# Altium project bldcDriver.PrjPcb
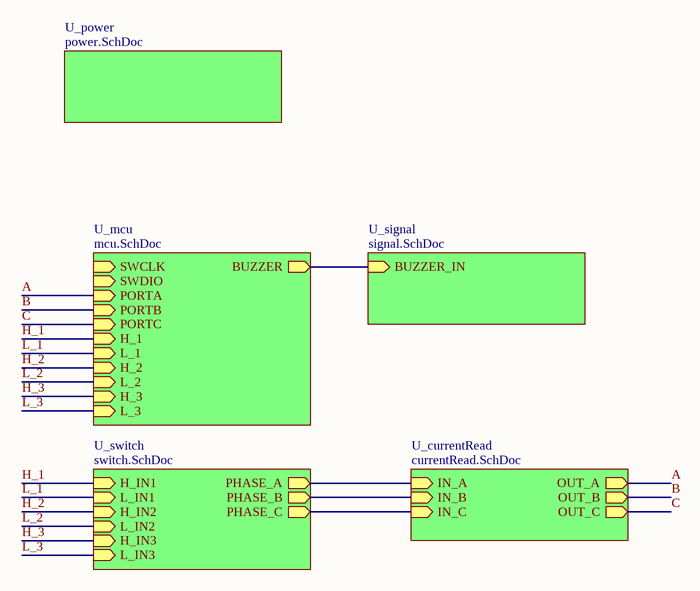
[diagram p0: main.SchDoc]
8 sheets, 67 parts. Net scope: hierarchical (ports join the sheet entries above them; power ports are global).
Board file: bldcPCB.PcbDoc
Sheets:
  main.SchDoc
    U_currentRead = currentRead.SchDoc
    U_power = power.SchDoc
    U_signal = signal.SchDoc
    U_switch = switch.SchDoc
    U_mcu = mcu.SchDoc
  requirements.SchDoc
  calculations.SchDoc

## Sheet main.SchDoc
size A4

### Sub-sheets
U_currentRead = currentRead.SchDoc: OUT_A (out), IN_A (in), OUT_B (out), IN_B (in), OUT_C (out), IN_C (in)
U_mcu = mcu.SchDoc: SWCLK (in), SWDIO (in), PORTA (in), PORTB (in), PORTC (in), BUZZER (out), H_1 (in), L_1 (in), H_2 (in), L_2 (in), H_3 (in), L_3 (in)
U_power = power.SchDoc: no entries
U_signal = signal.SchDoc: BUZZER_IN (in)
U_switch = switch.SchDoc: H_IN1 (in), L_IN1 (in), PHASE_A (out), H_IN2 (in), L_IN2 (in), PHASE_B (out), H_IN3 (in), L_IN3 (in), PHASE_C (out)

### Nets
A: sheet U_currentRead/OUT_A, sheet U_mcu/PORTA
B: sheet U_currentRead/OUT_B, sheet U_mcu/PORTB
C: sheet U_currentRead/OUT_C, sheet U_mcu/PORTC
H_1: sheet U_switch/H_IN1, sheet U_mcu/H_1
H_2: sheet U_switch/H_IN2, sheet U_mcu/H_2
H_3: sheet U_switch/H_IN3, sheet U_mcu/H_3
L_1: sheet U_switch/L_IN1, sheet U_mcu/L_1
L_2: sheet U_switch/L_IN2, sheet U_mcu/L_2
L_3: sheet U_switch/L_IN3, sheet U_mcu/L_3
NetC3_2: sheet U_currentRead/IN_A, sheet U_switch/PHASE_A
NetC4_2: sheet U_currentRead/IN_C, sheet U_switch/PHASE_C
NetC8_2: sheet U_currentRead/IN_B, sheet U_switch/PHASE_B
NetR23_2: sheet U_signal/BUZZER_IN, sheet U_mcu/BUZZER

## Sheet currentRead.SchDoc
size A4
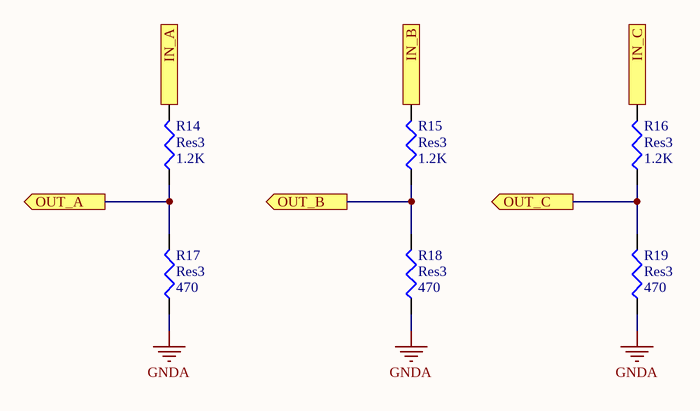
[diagram p1: currentRead.SchDoc]

### Parts
R14  Res3  value 1.2K  [12Z-2010]
R15  Res3  value 1.2K  [12Z-2010]
R16  Res3  value 1.2K  [12Z-2010]
R17  Res3  value 470  [12Z-2010]
R18  Res3  value 470  [12Z-2010]
R19  Res3  value 470  [12Z-2010]

### Ports
IN_A (in), IN_B (in), IN_C (in), OUT_A (out), OUT_B (out), OUT_C (out)

### Nets
GNDA: R17.1 R18.1 R19.1  [project net COMM]
A: R14.1 R17.2 ; port OUT_A
B: R15.1 R18.2 ; port OUT_B
C: R16.1 R19.2 ; port OUT_C
NetC3_2: R14.2 ; port IN_A
NetC4_2: R16.2 ; port IN_C
NetC8_2: R15.2 ; port IN_B

### Library data of the parts
R14-R19 = Res3: Resistor; Published: 8-Jun-2000; LatestRevisionDate: 29-May-2009; LatestRevisionNote: IPC-7351 Footprint Added.; PackageReference: J1-0603; Publisher: Altium Limited; PackageDescription: Chip Resistor

## Sheet power.SchDoc
size A4
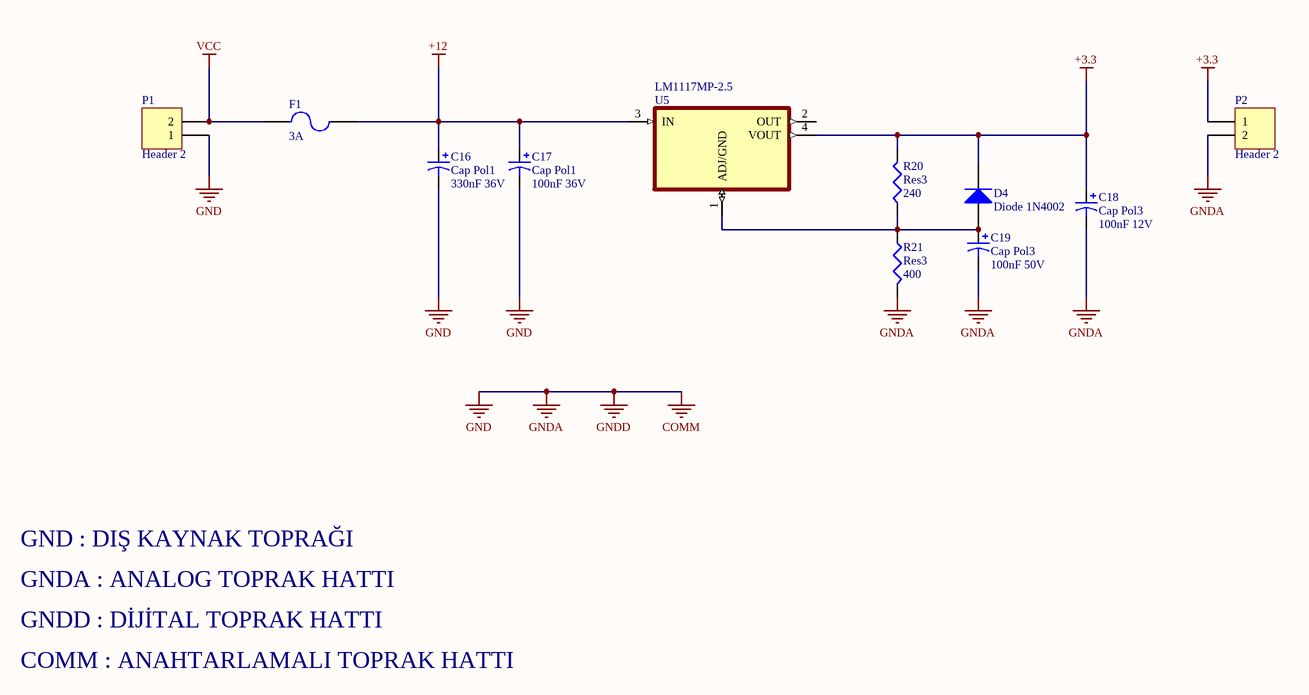
[diagram p2: power.SchDoc]

### Parts
C16  Cap Pol1  value 330nF 36V  [RB7.6-15]
C17  Cap Pol1  value 100nF 36V  [RB7.6-15]
C18  Cap Pol3  value 100nF 12V  [C0805]
C19  Cap Pol3  value 100nF 50V  [C0805]
D4  Diode 1N4002  [DO-41]
F1  3A  [PIN-W2/E2.8]
P1  Header 2  [HDR1X2]
P2  Header 2  [HDR1X2]
R20  Res3  value 240  [J1-0603]
R21  Res3  value 400  [J1-0603]
U5  LM1117MP-2.5  [LM1117 SMD]

### Nets
+3.3: C18.1 D4.2(K) P2.1 R20.2 U5.4(VOUT)
+12: C16.1 C17.1 F1.2 U5.3(IN)
COMM: C16.2 C17.2 C18.2 C19.2 P1.1 P2.2 R21.2  [also labelled GND, GNDA, GNDD]
VCC: F1.1 P1.2
NetC19_1: C19.1 D4.1(A) R20.1 R21.1 U5.1(ADJ/GND)

Not connected (* = marked no-connect by the designer): U5 2(OUT)

### Notes on the sheet
- GND : DIŞ KAYNAK TOPRAĞI
- GNDA : ANALOG TOPRAK HATTI
- GNDD : DİJİTAL TOPRAK HATTI
- COMM : ANAHTARLAMALI TOPRAK HATTI

### Library data of the parts
C16 C17 = Cap Pol1: Polarized Capacitor (Radial); Published: 8-Jun-2000; LatestRevisionDate: 17-Jul-2002; LatestRevisionNote: Re-released for DXP Platform.; PackageReference: RB7.6-15; Publisher: Altium Limited; PackageDescription: Polarized Capacitor (Radial); 2 Leads
C18 C19 = Cap Pol3: Polarized Capacitor (Surface Mount); Published: 8-Jun-2000; LatestRevisionDate: 29-May-2009; LatestRevisionNote: IPC-7351 Footprint Added.; PackageReference: C0805; Publisher: Altium Limited; PackageDescription: Chip Capacitor
D4 = Diode 1N4007: 1 Amp General Purpose Rectifier; Published: 8-Jun-2000; LatestRevisionDate: 17-Jul-2002; LatestRevisionNote: Re-released for DXP Platform.; DatasheetVersion: 1998; PackageVersion: Aug-1999; PackageReference: DO-41; Publisher: Altium Limited; PackageDescription: Diode, Axial; Body 5.2 x 2.7 mm (LxDia. max), Lead Dia. 0.86 mm (max); Code_JEDEC: DO-204-AL; ComponentLink1Description: Manufacturer Link; ComponentLink1URL: http://www.fairchildsemi.com/; ComponentLink2Description: Datasheet; ComponentLink2URL: http://www.fairchildsemi.com/ds/1N%2F1N4001.pdf
F1 = Fuse 2: Fuse; Published: 8-Jun-2000; LatestRevisionDate: 17-Jul-2002; LatestRevisionNote: Re-released for DXP Platform.; PackageReference: PIN-W2/E2.8; Publisher: Altium Limited; PackageDescription: Thru-Hole; 2 Leads
P1 P2 = Header 2: Header, 2-Pin; LatestRevisionDate: 17-Jul-2002; LatestRevisionNote: Re-released for DXP Platform.; Publisher: Altium Limited
R20 R21 = Res3: Resistor; Published: 8-Jun-2000; LatestRevisionDate: 29-May-2009; LatestRevisionNote: IPC-7351 Footprint Added.; PackageReference: J1-0603; Publisher: Altium Limited; PackageDescription: Chip Resistor
U5 = LM1117MP-2.5: 800-mA 15-V linear voltage regulator 4-SOT-223 0 to 125; MP: LM1117MP-2.5/NOPB; MF: Texas Instruments; Purchase-URL: https://pricing.snapeda.com/search/part/LM1117MP-2.5/NOPB/?ref=eda; SnapEDA_Link: https://www.snapeda.com/parts/LM1117MP-2.5/NOPB/Texas%20Instruments/view-part/108187/?ref=snap; Availability: Warning; Package: SOT-223-4 Texas Instruments; Value: *; Price: None; Check_prices: https://www.snapeda.com/parts/LM1117MP-2.5/NOPB/Texas%20Instruments/view-part/108187/?ref=eda

## Sheet signal.SchDoc
size A4
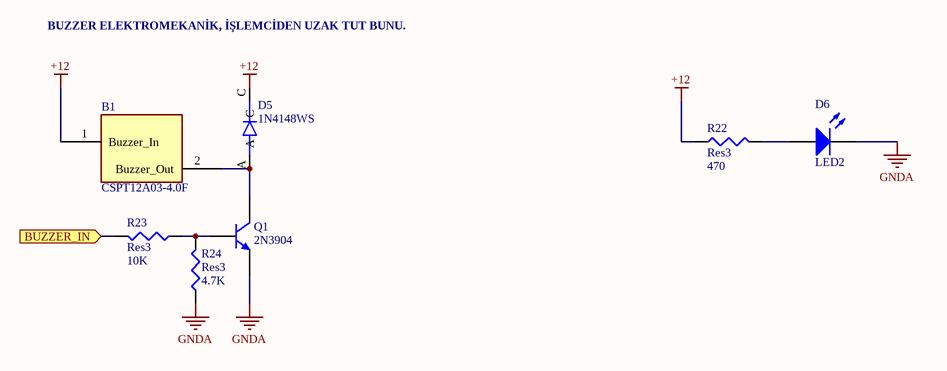
[diagram p3: signal.SchDoc]

### Parts
B1  CSPT12A03-4.0F  [Buzzer SMD]
D5  1N4148WS  [1N4148WS]
D6  LED2  [3.2X1.6X1.1]
Q1  2N3904  [TO-92A]
R22  Res3  value 470  [12Z-2010]
R23  Res3  value 10K  [J1-0603]
R24  Res3  value 4.7K  [J1-0603]

### Ports
BUZZER_IN (in)

### Nets
+12: B1.1(Buzzer_In) D5.C R22.1
GNDA: D6.2(K) Q1.1(E) R24.1  [project net COMM]
NetB1_2: B1.2(Buzzer_Out) D5.A Q1.3(C)
NetD6_1: D6.1(A) R22.2
NetQ1_2: Q1.2(B) R23.1 R24.2
NetR23_2: R23.2 ; port BUZZER_IN

### Notes on the sheet
- BUZZER ELEKTROMEKANİK, İŞLEMCİDEN UZAK TUT BUNU.

### Library data of the parts
B1 = Buzzer SMD 5MM: 12V 1mA 5MM 85dB 7.5X7.5X2 SMD Buzzer without circuit
D5 = 1N4148WS: Diode Standard 75V 150mA Surface Mount SOD-323F; MF: ON Semiconductor; Price: None; SnapEDA_Link: https://www.snapeda.com/parts/1N4148WS/ON%20Semiconductor/view-part/2747266/?ref=snap; Check_prices: https://www.snapeda.com/parts/1N4148WS/ON%20Semiconductor/view-part/2747266/?ref=eda; MP: 1N4148WS; Availability: Good; Value: *; Purchase-URL: https://pricing.snapeda.com/search/part/1N4148WS/?ref=eda; Package: SOD-323FL-2 ON Semiconductor
D6 = LED2: Typical RED, GREEN, YELLOW, AMBER GaAs LED; Published: 8-Jun-2000; LatestRevisionDate: 17-Jul-2002; LatestRevisionNote: Re-released for DXP Platform.; PackageVersion: Feb-2002; PackageReference: 3.2X1.6X1.1; Publisher: Altium Limited; PackageDescription: SM LED; 2 Flat Leads
Q1 = 2N3904: NPN General Purpose Amplifier; Published: 8-Jun-2000; LatestRevisionDate: 15-Jan-2003; LatestRevisionNote: PCB Footprint 'BCY-W3/D4.7' replaced; DatasheetVersion: 1997; PackageVersion: Sep-1998; PackageReference: TO-92A; Publisher: Altium Limited; PackageDescription: TO, Flat Index; 3 In-Line, Axial Leads; Body Dia. 4.5mm; Leads 0.51 x 0.48 mm (max); ComponentLink1Description: Manufacturer Link; ComponentLink1URL: http://www.fairchildsemi.com/; ComponentLink2Description: Datasheet; ComponentLink2URL: http://www.fairchildsemi.com/ds/2N%2F2N3904.pdf
R22-R24 = Res3: Resistor; Published: 8-Jun-2000; LatestRevisionDate: 29-May-2009; LatestRevisionNote: IPC-7351 Footprint Added.; PackageReference: J1-0603; Publisher: Altium Limited; PackageDescription: Chip Resistor

## Sheet switch.SchDoc
size A4
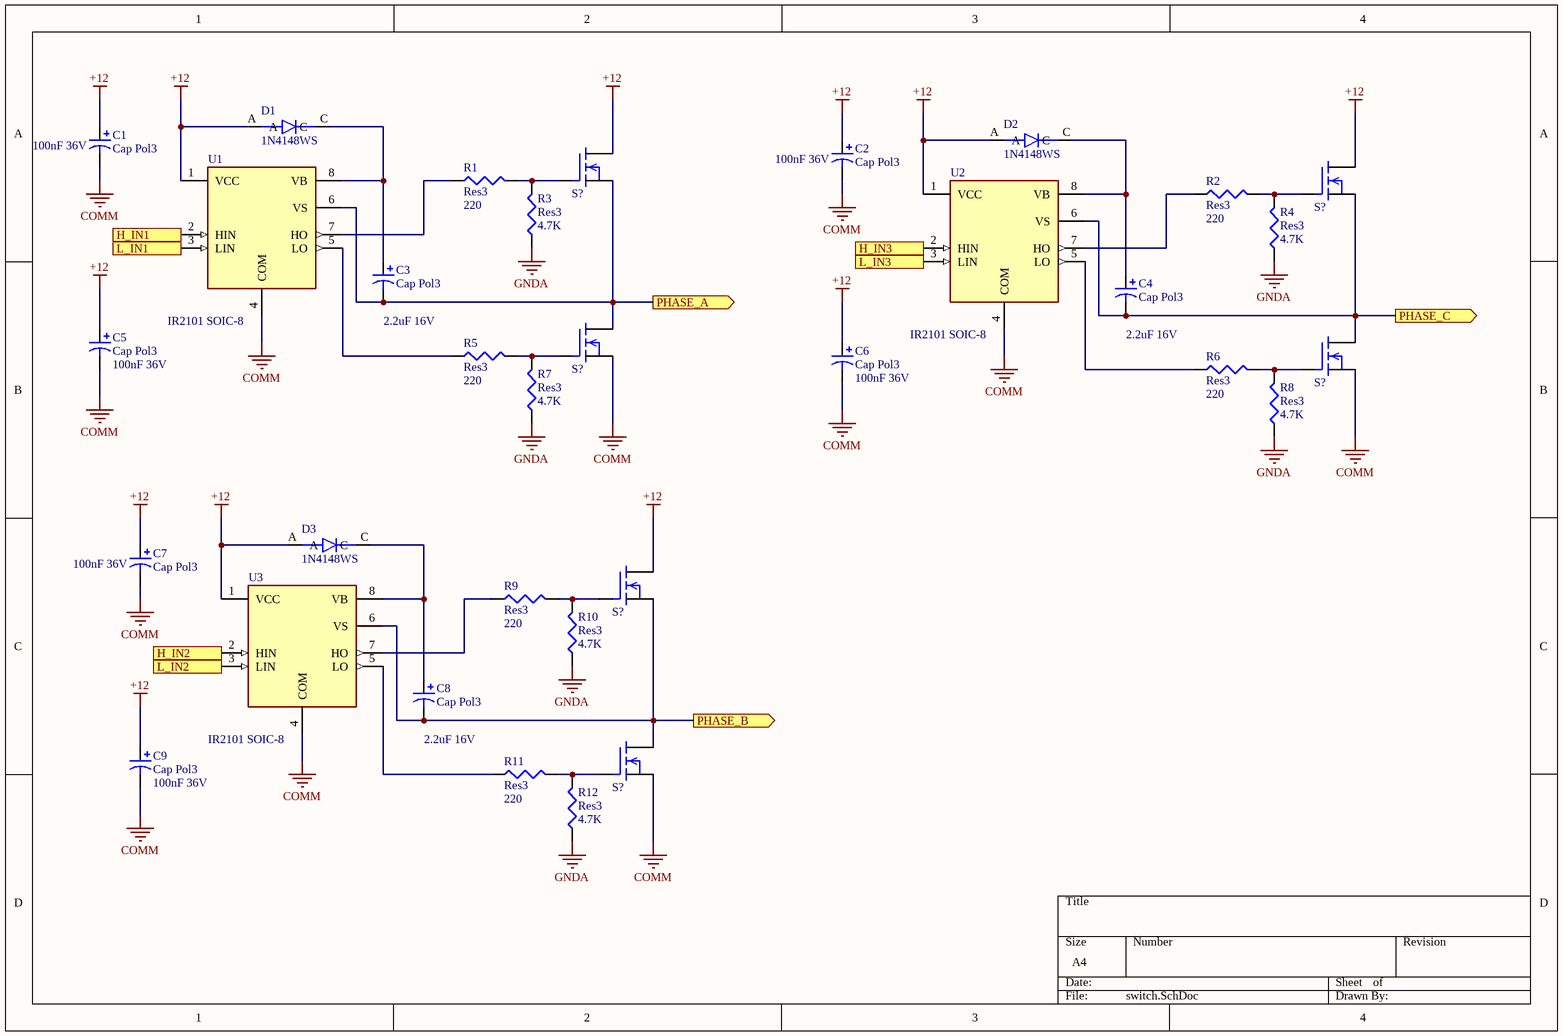
[diagram p4: switch.SchDoc]

### Parts
C1  Cap Pol3  value 100nF 36V  [C0805]
C2  Cap Pol3  value 100nF 36V  [C0805]
C3  Cap Pol3  value 2.2uF 16V  [C0805]
C4  Cap Pol3  value 2.2uF 16V  [C0805]
C5  Cap Pol3  value 100nF 36V  [C0805]
C6  Cap Pol3  value 100nF 36V  [C0805]
C7  Cap Pol3  value 100nF 36V  [C0805]
C8  Cap Pol3  value 2.2uF 16V  [C0805]
C9  Cap Pol3  value 100nF 36V  [C0805]
D1  1N4148WS  [1N4148WS]
D2  1N4148WS  [1N4148WS]
D3  1N4148WS  [1N4148WS]
NPN_1  S?  [UTM2054G - duplicate]
NPN_2  S?  [UTM2054G - duplicate]
NPN_3  S?  [UTM2054G - duplicate]
NPN_4  S?  [UTM2054G - duplicate]
NPN_5  S?  [UTM2054G - duplicate]
NPN_6  S?  [UTM2054G - duplicate]
R1  Res3  value 220  [J1-0603]
R2  Res3  value 220  [J1-0603]
R3  Res3  value 4.7K  [J1-0603]
R4  Res3  value 4.7K  [J1-0603]
R5  Res3  value 220  [J1-0603]
R6  Res3  value 220  [J1-0603]
R7  Res3  value 4.7K  [J1-0603]
R8  Res3  value 4.7K  [J1-0603]
R9  Res3  value 220  [J1-0603]
R10  Res3  value 4.7K  [J1-0603]
R11  Res3  value 220  [J1-0603]
R12  Res3  value 4.7K  [J1-0603]
U1  IR2101 SOIC-8  [IR2101]
U2  IR2101 SOIC-8  [IR2101]
U3  IR2101 SOIC-8  [IR2101]

### Ports
H_IN1 (in), H_IN2 (in), H_IN3 (in), L_IN1 (in), L_IN2 (in), L_IN3 (in), PHASE_A (out), PHASE_B (out), PHASE_C (out)

### Nets
+12: C1.1 C2.1 C5.1 C6.1 C7.1 C9.1 D1.A D2.A D3.A NPN_1.2(D) NPN_2.2(D) NPN_5.2(D) U1.1(VCC) U2.1(VCC) U3.1(VCC)
COMM: C1.2 C2.2 C5.2 C6.2 C7.2 C9.2 NPN_3.3(S) NPN_4.3(S) NPN_6.3(S) R3.1 R4.1 R7.1 R8.1 R10.1 R12.1 U1.4(COM) U2.4(COM) U3.4(COM)  [also labelled GNDA]
H_1: U1.2(HIN) ; port H_IN1
H_2: U3.2(HIN) ; port H_IN2
H_3: U2.2(HIN) ; port H_IN3
L_1: U1.3(LIN) ; port L_IN1
L_2: U3.3(LIN) ; port L_IN2
L_3: U2.3(LIN) ; port L_IN3
NetC3_1: C3.1 D1.C U1.8(VB)
NetC3_2: C3.2 NPN_1.3(S) NPN_3.2(D) U1.6(VS) ; port PHASE_A
NetC4_1: C4.1 D2.C U2.8(VB)
NetC4_2: C4.2 NPN_2.3(S) NPN_4.2(D) U2.6(VS) ; port PHASE_C
NetC8_1: C8.1 D3.C U3.8(VB)
NetC8_2: C8.2 NPN_5.3(S) NPN_6.2(D) U3.6(VS) ; port PHASE_B
NetNPN_1_1: NPN_1.1(G) R1.2 R3.2
NetNPN_2_1: NPN_2.1(G) R2.2 R4.2
NetNPN_3_1: NPN_3.1(G) R5.2 R7.2
NetNPN_4_1: NPN_4.1(G) R6.2 R8.2
NetNPN_5_1: NPN_5.1(G) R9.2 R10.2
NetNPN_6_1: NPN_6.1(G) R11.2 R12.2
NetR1_1: R1.1 U1.7(HO)
NetR2_1: R2.1 U2.7(HO)
NetR5_1: R5.1 U1.5(LO)
NetR6_1: R6.1 U2.5(LO)
NetR9_1: R9.1 U3.7(HO)
NetR11_1: R11.1 U3.5(LO)

### Library data of the parts
C1-C9 = Cap Pol3: Polarized Capacitor (Surface Mount); Published: 8-Jun-2000; LatestRevisionDate: 29-May-2009; LatestRevisionNote: IPC-7351 Footprint Added.; PackageReference: C0805; Publisher: Altium Limited; PackageDescription: Chip Capacitor
D1-D3 = 1N4148WS: as D5 on sheet signal; Price: None; SnapEDA_Link: https://www.snapeda.com/parts/1N4148WS/ON%20Semiconductor/view-part/2747266/?ref=snap; Check_prices: https://www.snapeda.com/parts/1N4148WS/ON%20Semiconductor/view-part/2747266/?ref=eda; MP: 1N4148WS; Availability: Good; Value: *; Purchase-URL: https://pricing.snapeda.com/search/part/1N4148WS/?ref=eda; Package: SOD-323FL-2 ON Semiconductor
NPN_1-NPN_6 = UTM2054
R1-R12 = Res3: Resistor; Published: 8-Jun-2000; LatestRevisionDate: 29-May-2009; LatestRevisionNote: IPC-7351 Footprint Added.; PackageReference: J1-0603; Publisher: Altium Limited; PackageDescription: Chip Resistor
U1-U3 = IR2101 SOIC-8: Half-Bridge Gate Driver IC Non-Inverting 8-SOIC; MF: Infineon Technologies; Availability: Unavailable; Value: *; Package: SOIC-8 Infineon; Price: None; MP: IR2101S; SnapEDA_Link: https://www.snapeda.com/parts/IR2101S/Infineon%20Technologies/view-part/589975/?ref=snap; BuyPart: https://www.snapeda.com/parts/IR2101S/Infineon%20Technologies/view-part/589975/?ref=eda

## Sheet mcu.SchDoc
size A4
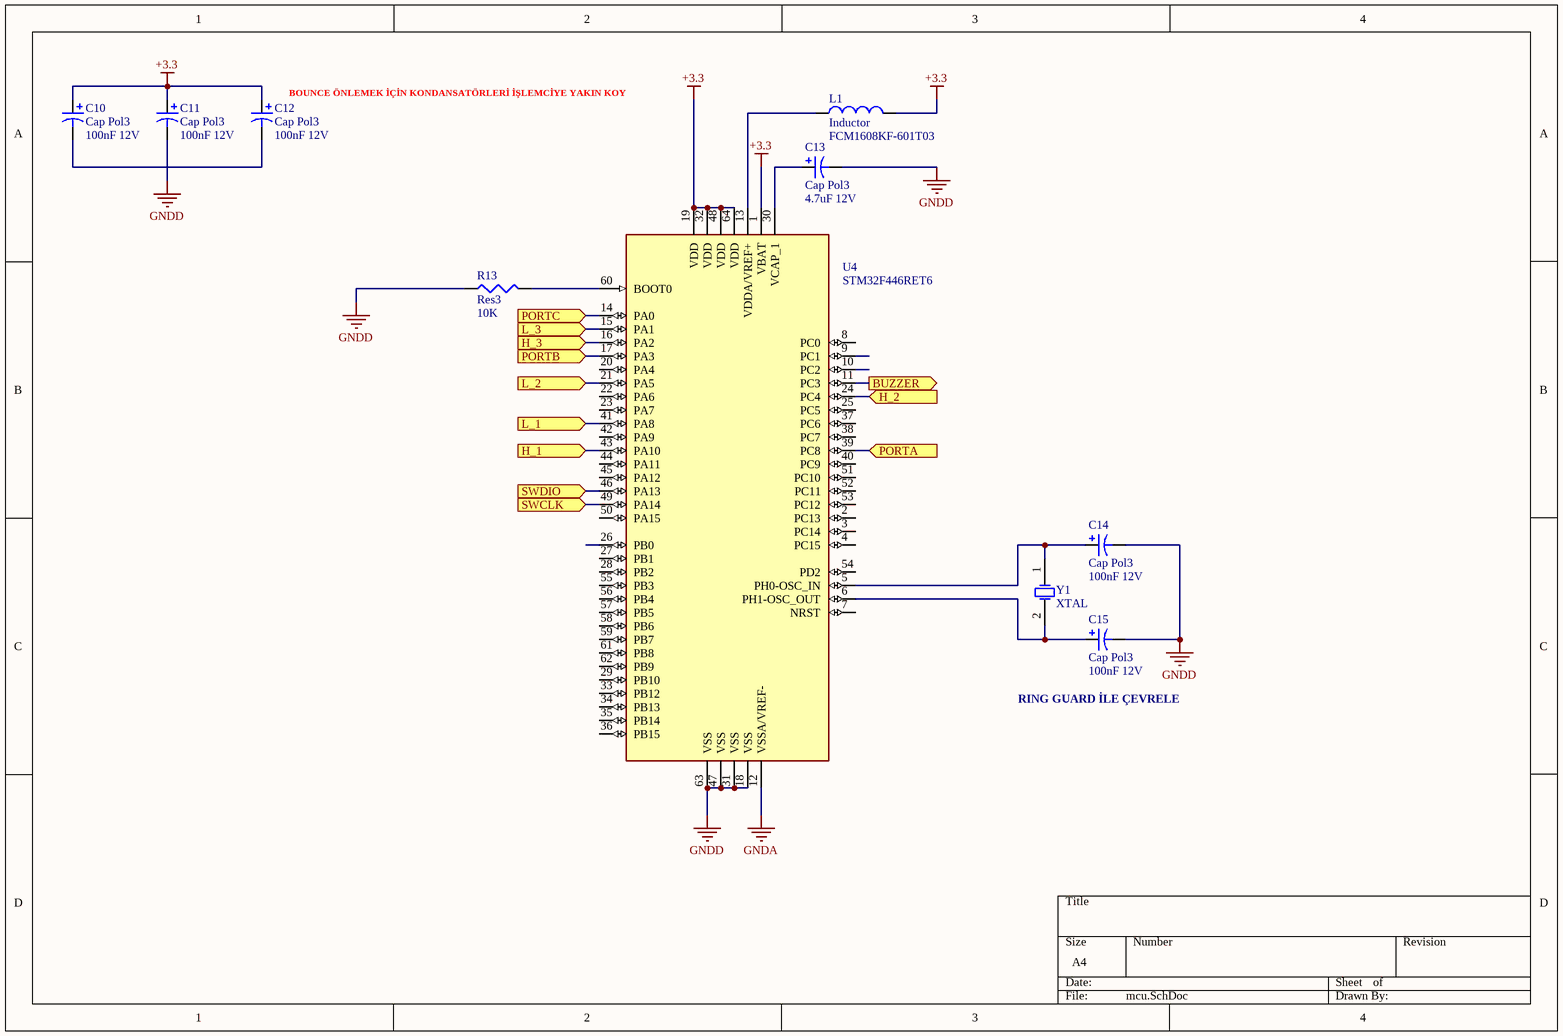
[diagram p5: mcu.SchDoc]

### Parts
C10  Cap Pol3  value 100nF 12V  [C0805]
C11  Cap Pol3  value 100nF 12V  [C0805]
C12  Cap Pol3  value 100nF 12V  [C0805]
C13  Cap Pol3  value 4.7uF 12V  [C0805]
C14  Cap Pol3  value 100nF 12V  [C0805]
C15  Cap Pol3  value 100nF 12V  [C0805]
L1  Inductor  value FCM1608KF-601T03  [0402-A]
R13  Res3  value 10K  [J1-0603]
U4  STM32F446RET6  [STM32F4]
Y1  XTAL  [R38]

### Ports
BUZZER (out), H_1 (in), H_2 (in), H_3 (in), L_1 (in), L_2 (in), L_3 (in), PORTA (in), PORTB (in), PORTC (in), SWCLK (in), SWDIO (in)

### Nets
+3.3: C10.1 C11.1 C12.1 L1.2 U4.1(VBAT) U4.19(VDD) U4.32(VDD) U4.48(VDD) U4.64(VDD)
GNDA: C11.2 C13.2 C14.2 C15.2 R13.1 U4.12(VSSA/VREF-) U4.18(VSS) U4.31(VSS) U4.47(VSS) U4.63(VSS)  [also labelled GNDD]  [project net COMM]
A: U4.39(PC8) ; port PORTA
B: U4.17(PA3) ; port PORTB
C: U4.14(PA0) ; port PORTC
H_1: U4.43(PA10) ; port H_1
H_2: U4.24(PC4) ; port H_2
H_3: U4.16(PA2) ; port H_3
L_1: U4.41(PA8) ; port L_1
L_2: U4.21(PA5) ; port L_2
L_3: U4.15(PA1) ; port L_3
NetC10_2: C10.2 C12.2
NetC13_1: C13.1 U4.30(VCAP_1)
NetC14_1: C14.1 U4.5(PH0-OSC_IN) Y1.1(OSC1)
NetC15_1: C15.1 U4.6(PH1-OSC_OUT) Y1.2(OSC2)
NetL1_1: L1.1 U4.13(VDDA/VREF+)
NetR13_2: R13.2 U4.60(BOOT0)
NetR23_2: U4.11(PC3) ; port BUZZER
NetU4_46: U4.46(PA13) ; port SWDIO
NetU4_49: U4.49(PA14) ; port SWCLK

Not connected (* = marked no-connect by the designer): U4 2(PC13) 3(PC14) 4(PC15) 7(NRST) 8(PC0) 9(PC1) 10(PC2) 20(PA4) 22(PA6) 23(PA7) 25(PC5) 26(PB0) 27(PB1) 28(PB2) 29(PB10) 33(PB12) 34(PB13) 35(PB14) 36(PB15) 37(PC6) 38(PC7) 40(PC9) 42(PA9) 44(PA11) 45(PA12) 50(PA15) 51(PC10) 52(PC11) 53(PC12) 54(PD2) 55(PB3) 56(PB4) 57(PB5) 58(PB6) 59(PB7) 61(PB8) 62(PB9)

### Notes on the sheet
- (near C12) BOUNCE ÖNLEMEK İÇİN KONDANSATÖRLERİ İŞLEMCİYE YAKIN KOY
- RING GUARD İLE ÇEVRELE

### Library data of the parts
C10-C15 = Cap Pol3: Polarized Capacitor (Surface Mount); Published: 8-Jun-2000; LatestRevisionDate: 29-May-2009; LatestRevisionNote: IPC-7351 Footprint Added.; PackageReference: C0805; Publisher: Altium Limited; PackageDescription: Chip Capacitor
L1 = Inductor: Code_IEC: 1005; Published: 8-Jun-2000; LatestRevisionDate: 29-May-2009; LatestRevisionNote: IPC-7351 Footprint Added.; PackageReference: 0402-A; Publisher: Altium Limited; PackageDescription: Chip Inductor; Code_JEITA: 0402
R13 = Res3: Resistor; Published: 8-Jun-2000; LatestRevisionDate: 29-May-2009; LatestRevisionNote: IPC-7351 Footprint Added.; PackageReference: J1-0603; Publisher: Altium Limited; PackageDescription: Chip Resistor
U4 = STM32F446RET6: MCU 32-Bit STM32 ARM Cortex M4 RISC 512KB Flash 2.5V/3.3V 64-Pin LQFP Tray; Availability: Unavailable; Package: None; MP: STM32F446RET6; Value: *; Price: None
Y1 = XTAL: Crystal Oscillator; Published: 8-Jun-2000; LatestRevisionDate: 17-Jul-2002; LatestRevisionNote: Re-released for DXP Platform.; PackageReference: R38; Publisher: Altium Limited; PackageDescription: Crystal, Thru-Hole; 2 Leads; Body 3.1 x 8.2 mm (Dia.xH)

## Sheet requirements.SchDoc
size A4
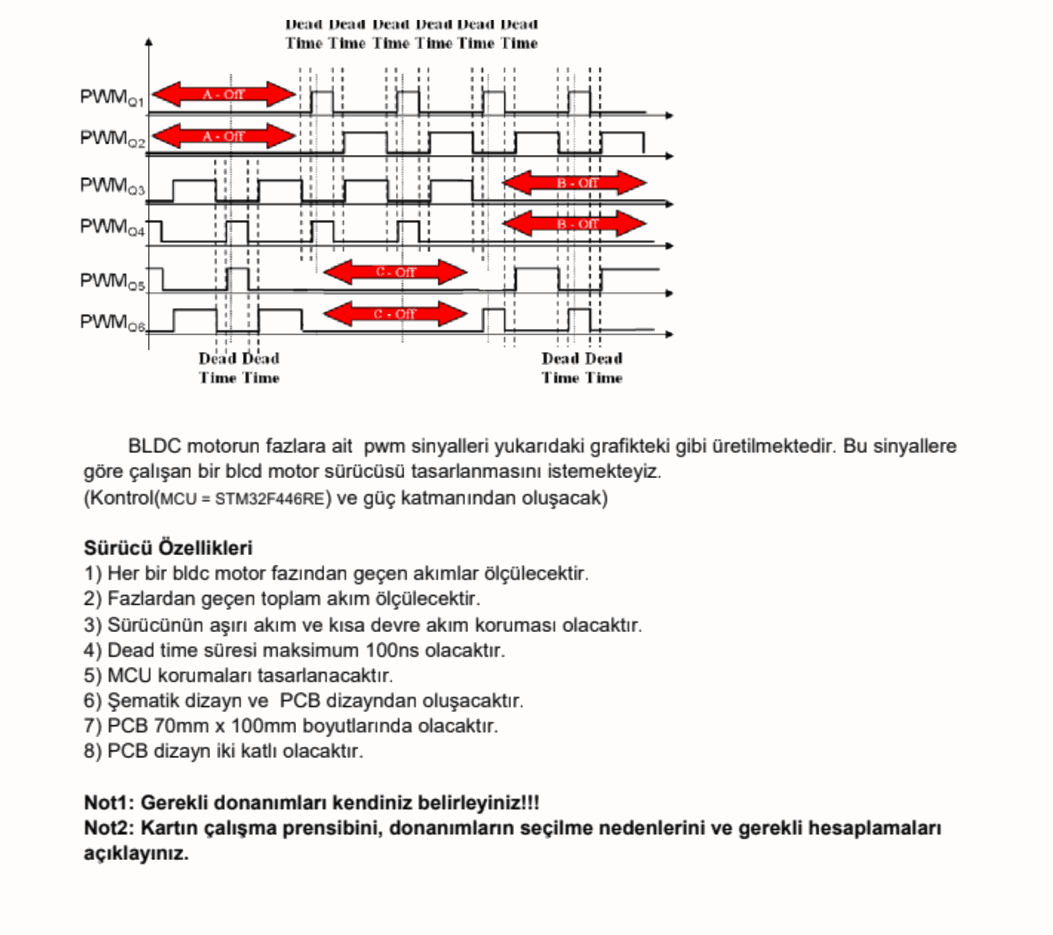
[diagram p6: requirements.SchDoc]

## Sheet calculations.SchDoc
size A4
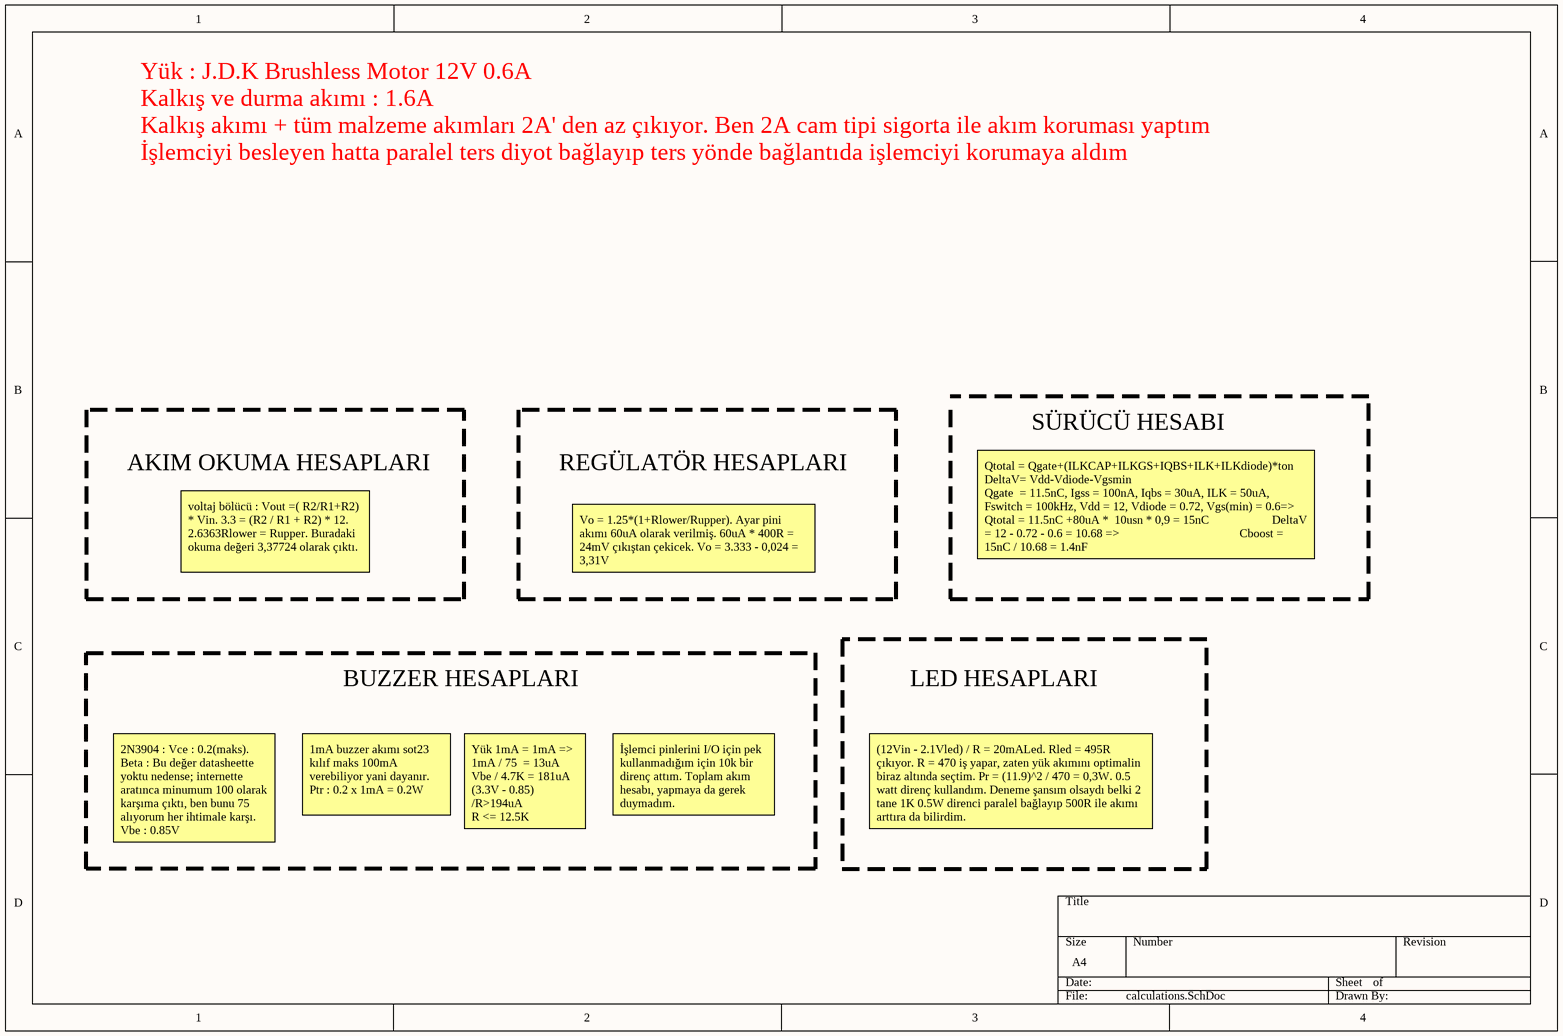
[diagram p7: calculations.SchDoc]

### Notes on the sheet
- Yük : J.D.K Brushless Motor 12V 0.6A
- Kalkış ve durma akımı : 1.6A
- Kalkış akımı + tüm malzeme akımları 2A' den az çıkıyor. Ben 2A cam tipi sigorta ile akım koruması yaptım
- İşlemciyi besleyen hatta paralel ters diyot bağlayıp ters yönde bağlantıda işlemciyi korumaya aldım
- SÜRÜCÜ HESABI
- AKIM OKUMA HESAPLARI
- REGÜLATÖR HESAPLARI
- voltaj bölücü : Vout =( R2/R1+R2) * Vin. 3.3 = (R2 / R1 + R2) * 12. 2.6363Rlower = Rupper. Buradaki okuma değeri 3,37724 olarak çıktı.
- Vo = 1.25*(1+Rlower/Rupper). Ayar pini akımı 60uA olarak verilmiş. 60uA * 400R =  24mV çıkıştan çekicek. Vo = 3.333 - 0,024 = 3,31V
- Qtotal = Qgate+(ILKCAP+ILKGS+IQBS+ILK+ILKdiode)*ton DeltaV= Vdd-Vdiode-Vgsmin
  Qgate  = 11.5nC, Igss = 100nA, Iqbs = 30uA, ILK = 50uA, Fswitch = 100kHz, Vdd = 12, Vdiode = 0.72, Vgs(min) = 0.6=> Qtotal = 11.5nC +80uA *  10usn * 0,9 = 15nC                     DeltaV = 12 - 0.72 - 0.6 = 10.68 =>                                        Cboost = 15nC / 10.68 = 1.4nF
- BUZZER HESAPLARI
- LED HESAPLARI
- 2N3904 : Vce : 0.2(maks). Beta : Bu değer datasheette yoktu nedense; internette aratınca minumum 100 olarak karşıma çıktı, ben bunu 75 alıyorum her ihtimale karşı. Vbe : 0.85V
- 1mA buzzer akımı sot23 kılıf maks 100mA verebiliyor yani dayanır. Ptr : 0.2 x 1mA = 0.2W
- Yük 1mA = 1mA => 1mA / 75  = 13uA Vbe / 4.7K = 181uA (3.3V - 0.85) /R>194uA                      R <= 12.5K
- İşlemci pinlerini I/O için pek kullanmadığım için 10k bir direnç attım. Toplam akım hesabı, yapmaya da gerek duymadım.
- (12Vin - 2.1Vled) / R = 20mALed. Rled = 495R çıkıyor. R = 470 iş yapar, zaten yük akımını optimalin biraz altında seçtim. Pr = (11.9)^2 / 470 = 0,3W. 0.5 watt direnç kullandım. Deneme şansım olsaydı belki 2 tane 1K 0.5W direnci paralel bağlayıp 500R ile akımı arttıra da bilirdim.

## Nets that join several sheets
+3.3: power (5 pins), mcu (9 pins)
+12: power (C16.1 C17.1 F1.2 U5.3), signal (B1.1 D5.C R22.1), switch (15 pins)
COMM: currentRead (R17.1 R18.1 R19.1), power (7 pins), signal (D6.2 Q1.1 R24.1), switch (18 pins), mcu (10 pins)
A: currentRead (R14.1 R17.2), mcu (U4.39)
B: currentRead (R15.1 R18.2), mcu (U4.17)
C: currentRead (R16.1 R19.2), mcu (U4.14)
H_1: switch (U1.2), mcu (U4.43)
H_2: switch (U3.2), mcu (U4.24)
H_3: switch (U2.2), mcu (U4.16)
L_1: switch (U1.3), mcu (U4.41)
L_2: switch (U3.3), mcu (U4.21)
L_3: switch (U2.3), mcu (U4.15)
NetC3_2: currentRead (R14.2), switch (C3.2 NPN_1.3 NPN_3.2 U1.6)
NetC4_2: currentRead (R16.2), switch (C4.2 NPN_2.3 NPN_4.2 U2.6)
NetC8_2: currentRead (R15.2), switch (C8.2 NPN_5.3 NPN_6.2 U3.6)
NetR23_2: signal (R23.2), mcu (U4.11)